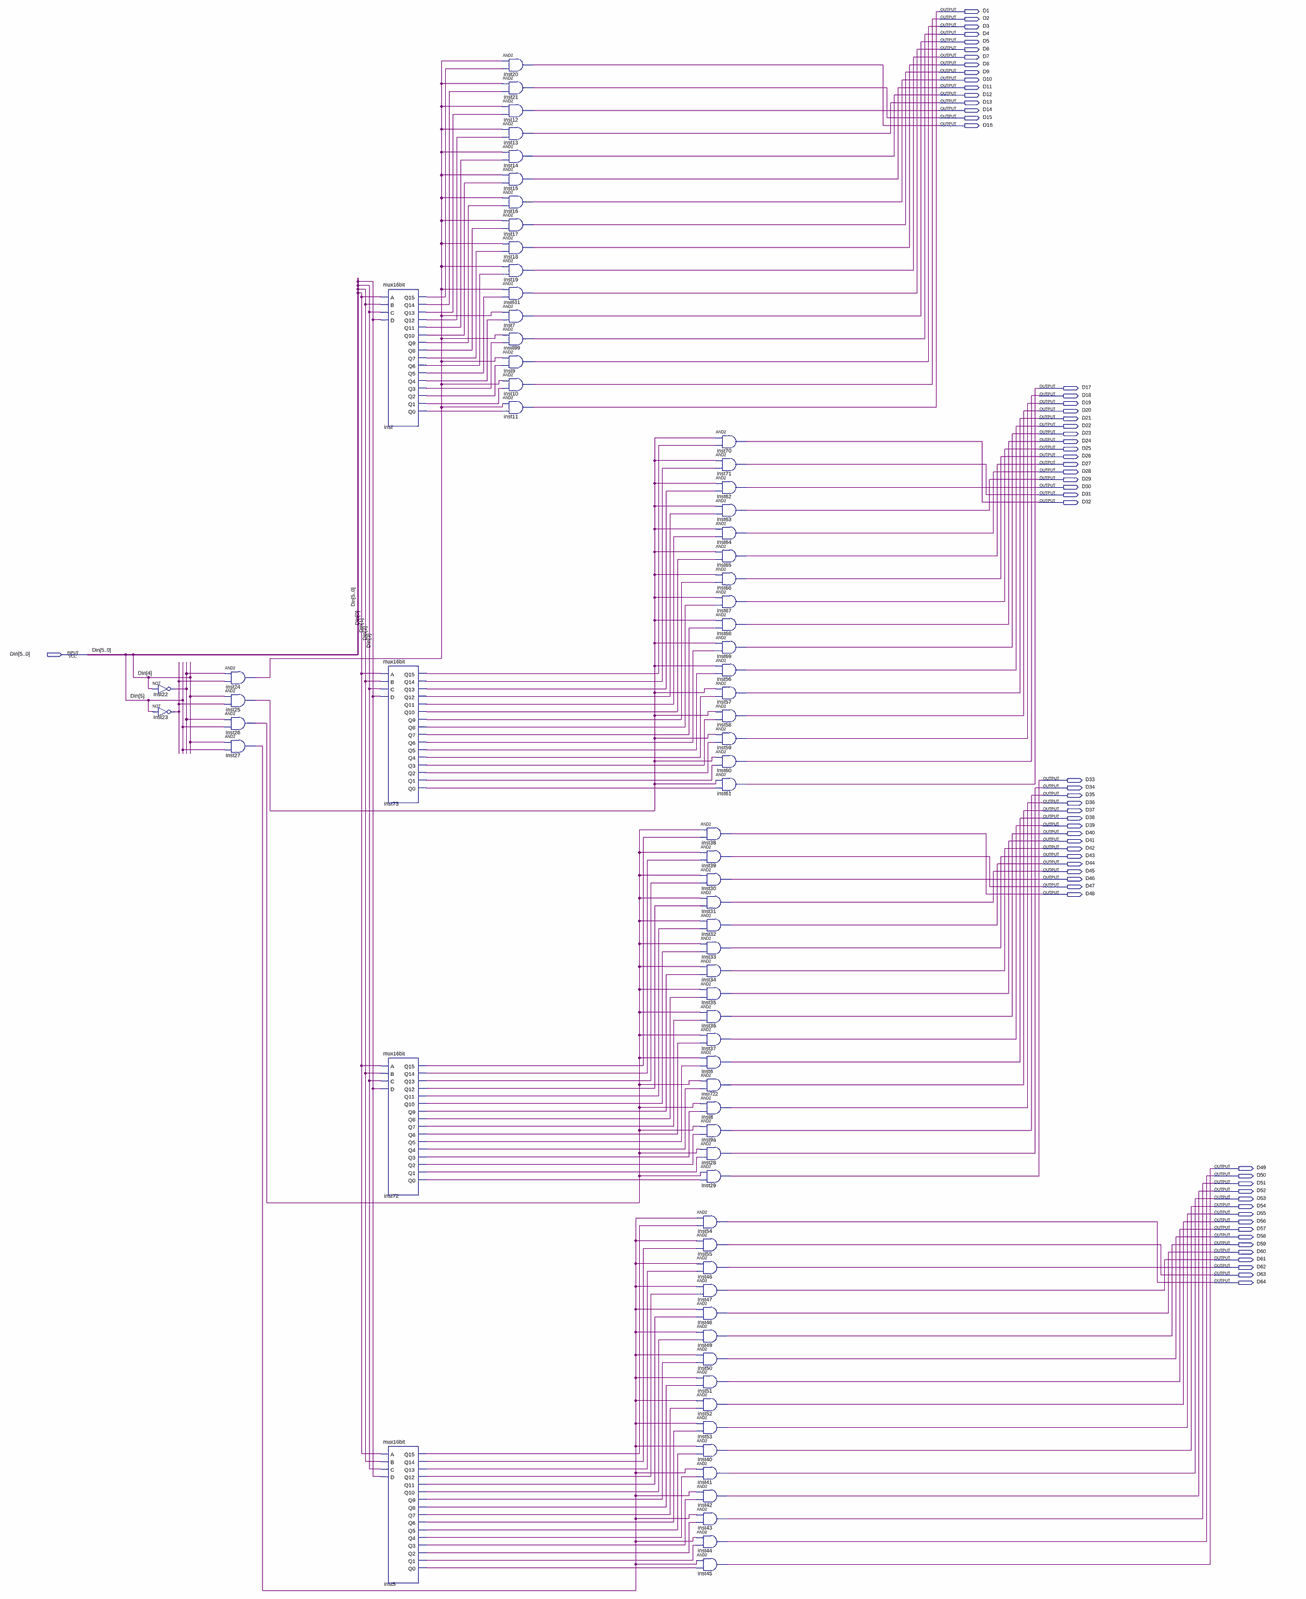
[diagram p0: schematic sheet, whole]
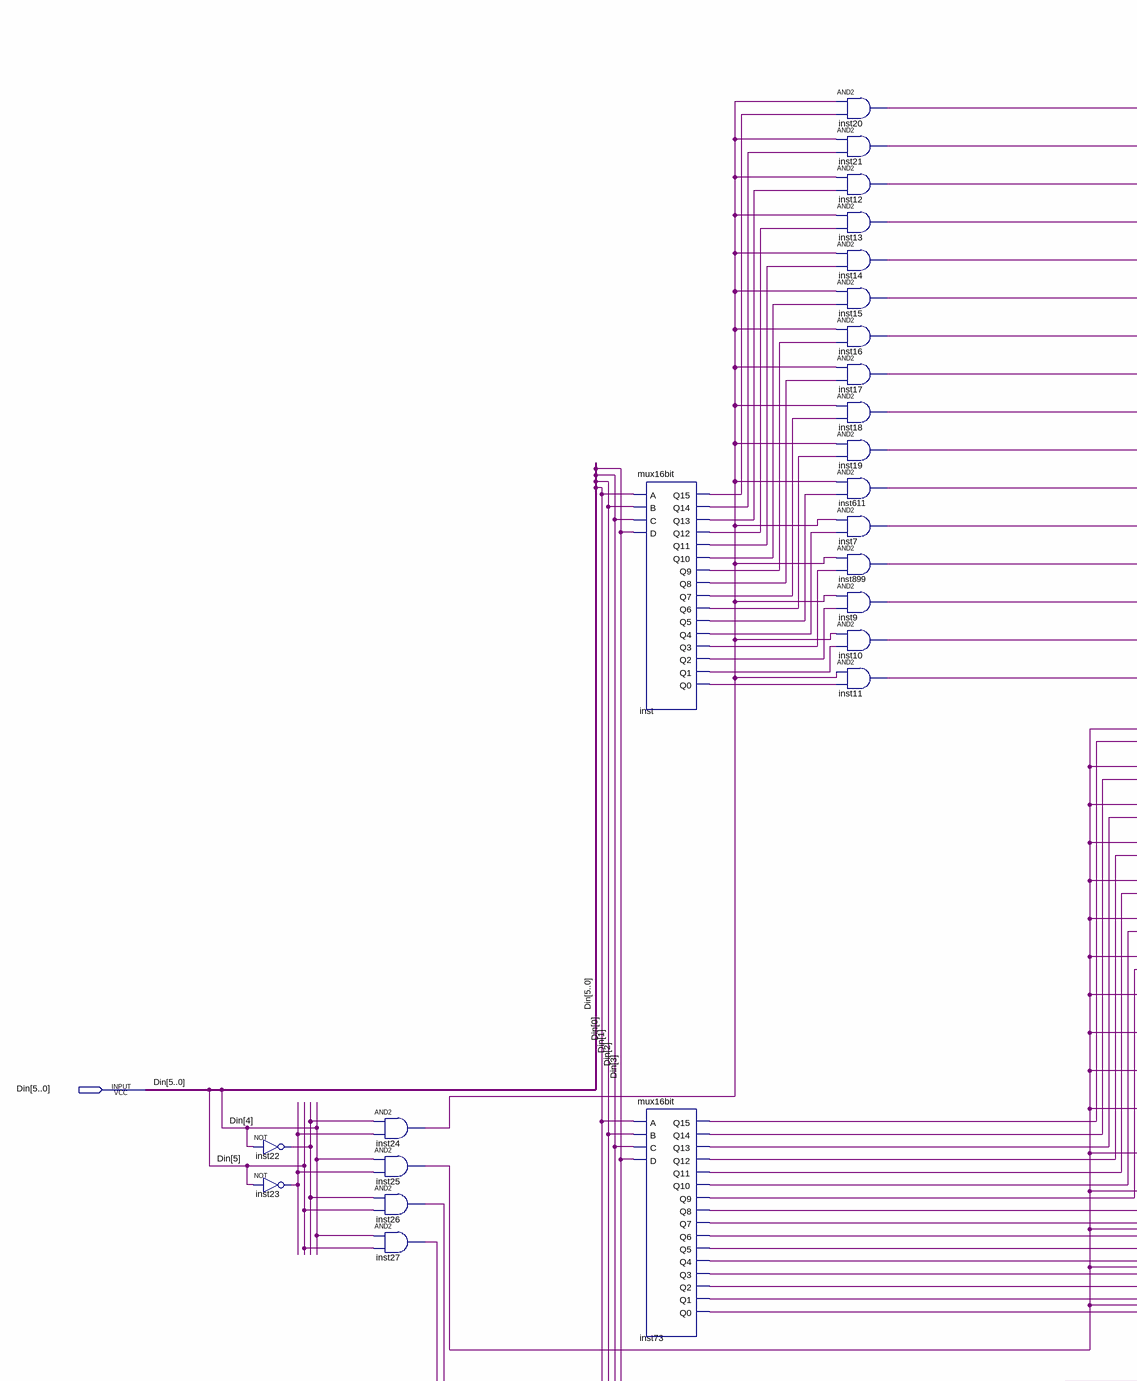
[diagram p1: schematic sheet, upper left part]
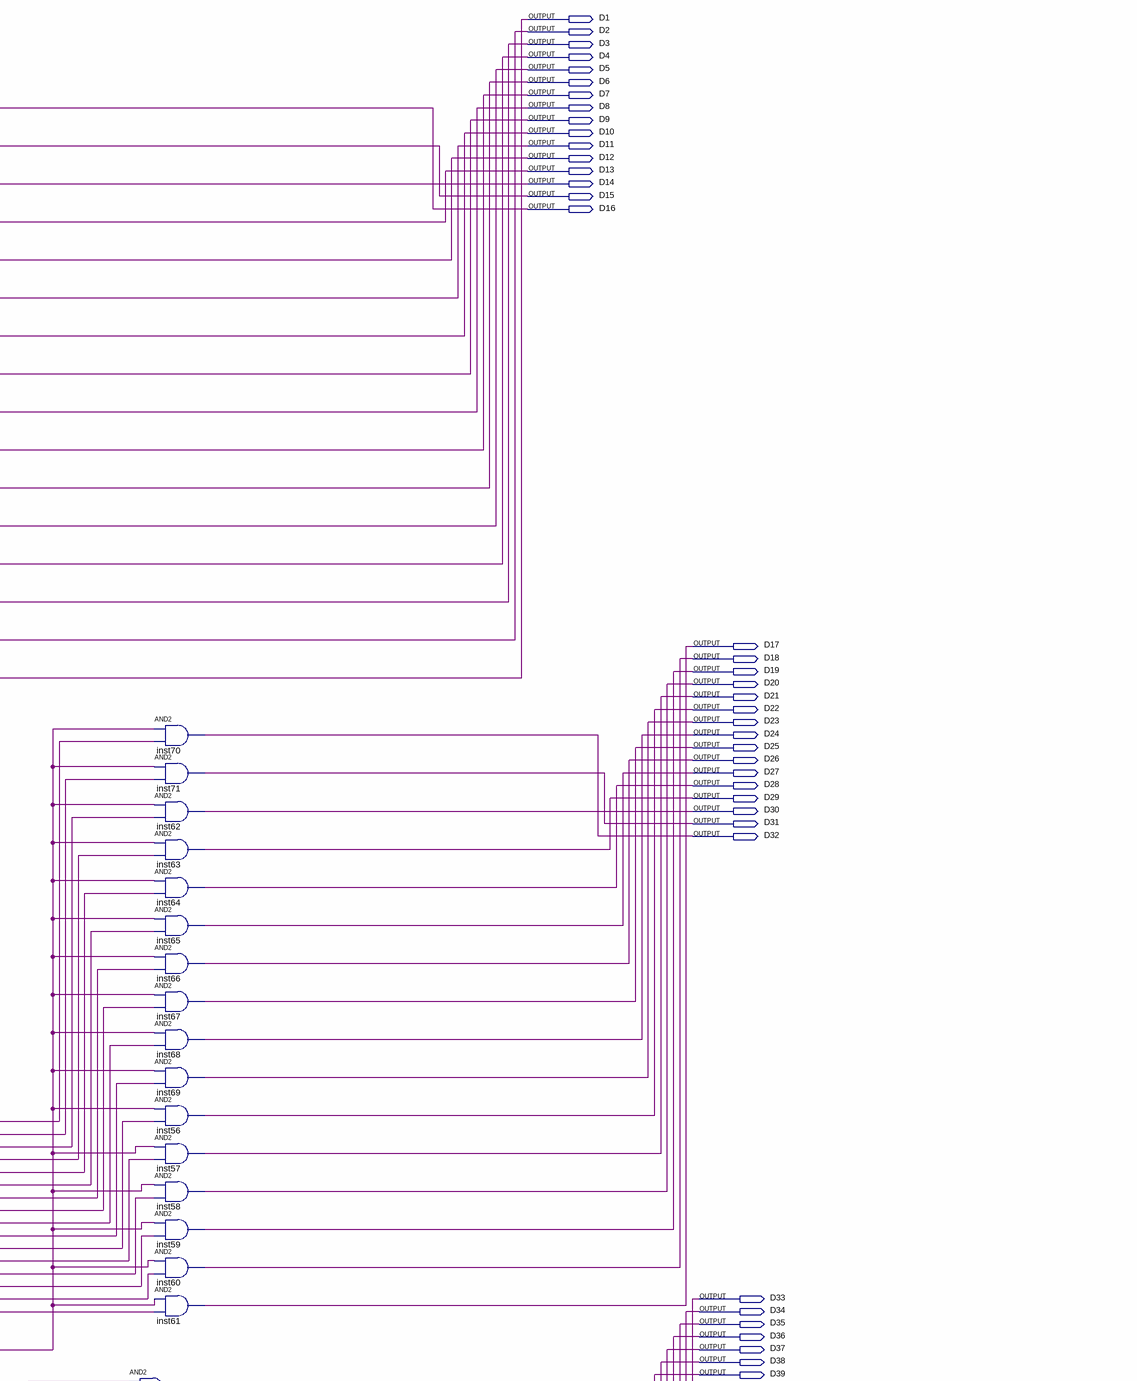
[diagram p2: schematic sheet, upper right part]
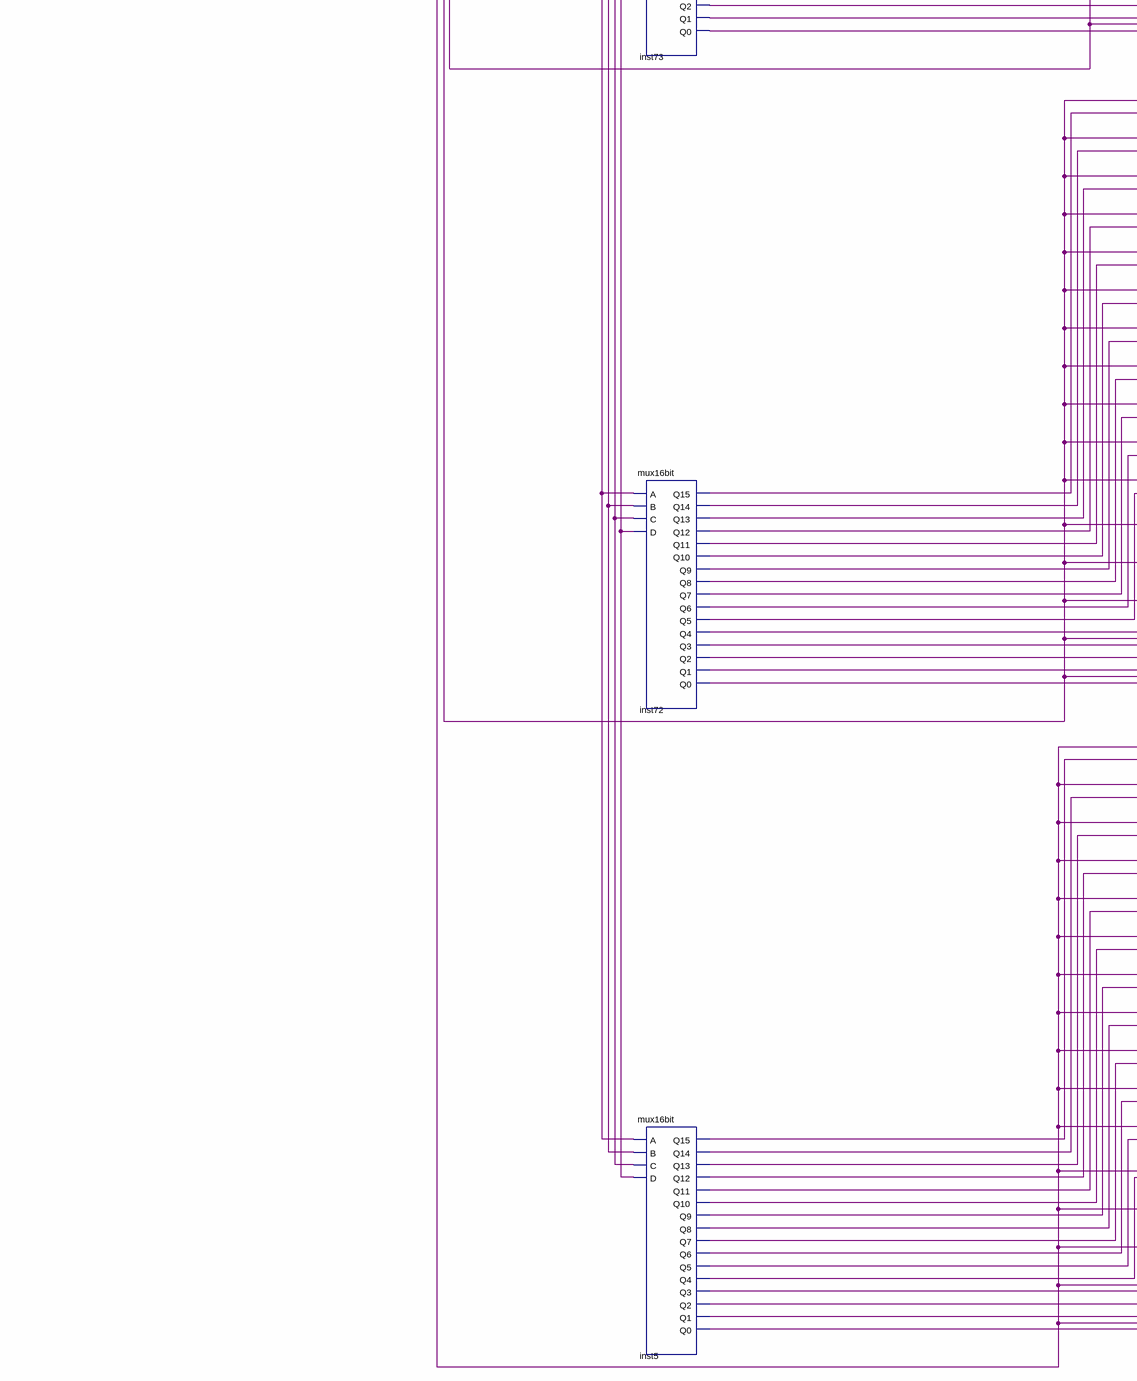
[diagram p3: schematic sheet, lower left part]
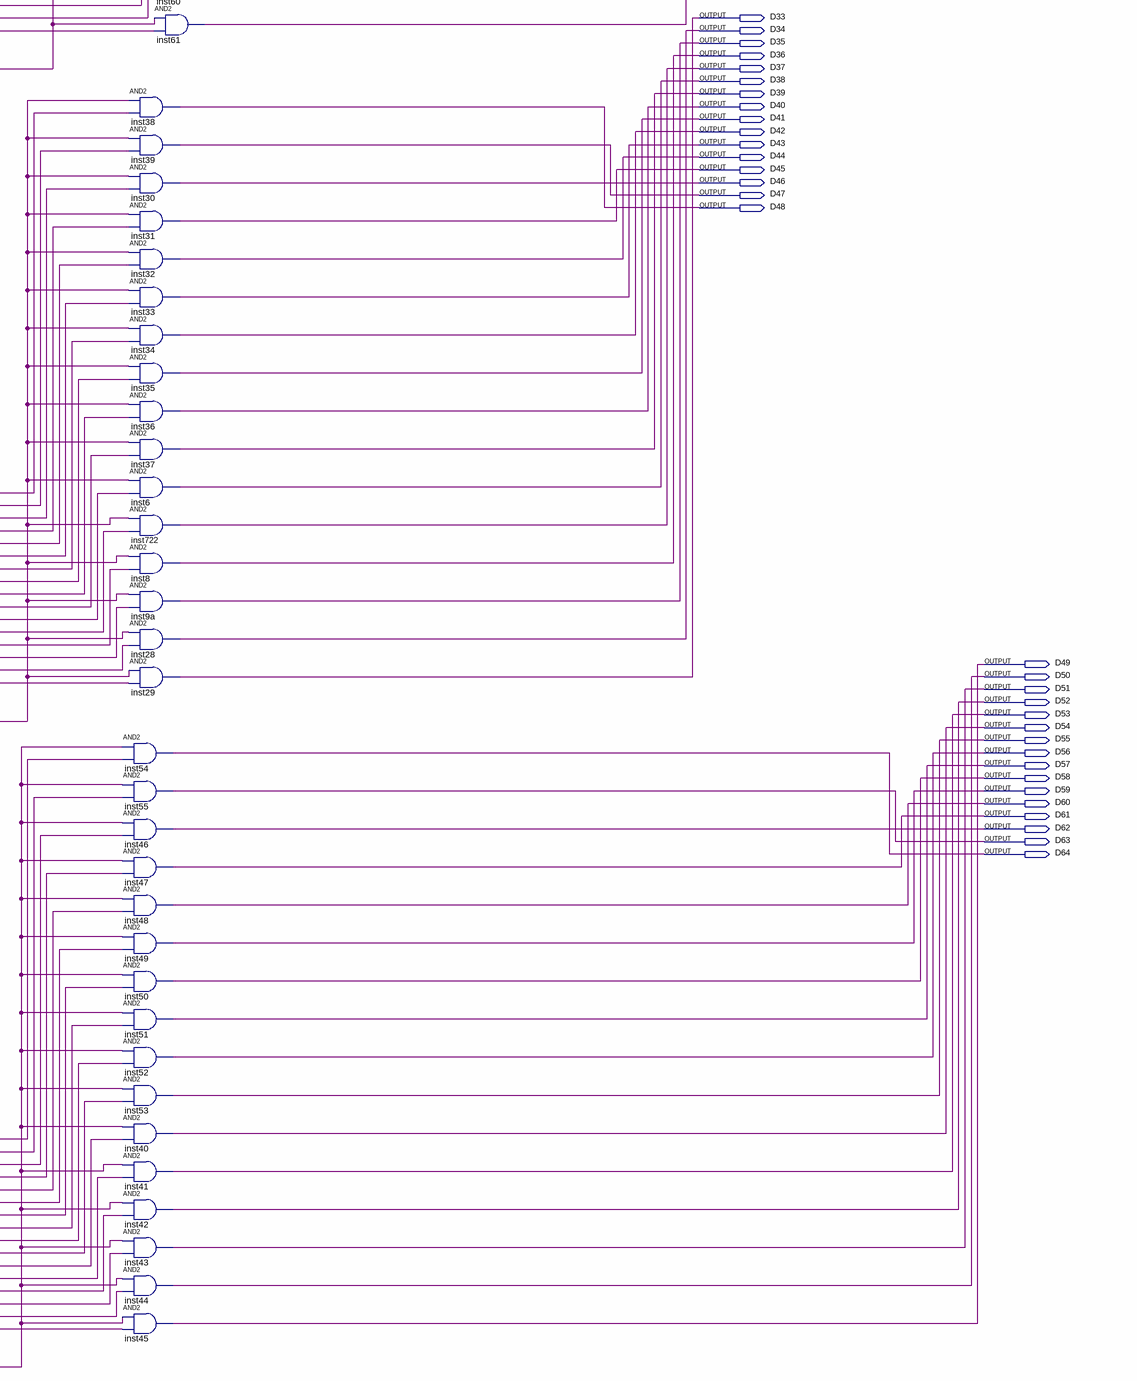
[diagram p4: schematic sheet, lower right part]
// Quartus schematic six_bit_decoder.bdf as structural Verilog: 74 symbols, 65 pins
module six_bit_decoder (
  input  [5:0] Din,
  output D1,
  output D2,
  output D3,
  output D4,
  output D5,
  output D6,
  output D7,
  output D8,
  output D9,
  output D10,
  output D11,
  output D12,
  output D13,
  output D14,
  output D15,
  output D16,
  output D17,
  output D18,
  output D19,
  output D20,
  output D21,
  output D22,
  output D23,
  output D24,
  output D25,
  output D26,
  output D27,
  output D28,
  output D29,
  output D30,
  output D31,
  output D32,
  output D33,
  output D34,
  output D35,
  output D36,
  output D37,
  output D38,
  output D39,
  output D40,
  output D41,
  output D42,
  output D43,
  output D44,
  output D45,
  output D46,
  output D47,
  output D48,
  output D49,
  output D50,
  output D51,
  output D52,
  output D53,
  output D54,
  output D55,
  output D56,
  output D57,
  output D58,
  output D59,
  output D60,
  output D61,
  output D62,
  output D63,
  output D64
);

  wire inst5_q0, inst5_q1, inst5_q2, inst5_q3, inst5_q4, inst5_q5, inst5_q6, inst5_q7, inst5_q8, inst5_q9,
       inst5_q10, inst5_q11, inst5_q12, inst5_q13, inst5_q14, inst5_q15, inst22_out, inst23_out, inst24_out,
       inst25_out, inst26_out, inst27_out, inst72_q0, inst72_q1, inst72_q2, inst72_q3, inst72_q4, inst72_q5,
       inst72_q6, inst72_q7, inst72_q8, inst72_q9, inst72_q10, inst72_q11, inst72_q12, inst72_q13,
       inst72_q14, inst72_q15, inst73_q0, inst73_q1, inst73_q2, inst73_q3, inst73_q4, inst73_q5, inst73_q6,
       inst73_q7, inst73_q8, inst73_q9, inst73_q10, inst73_q11, inst73_q12, inst73_q13, inst73_q14,
       inst73_q15, inst_q0, inst_q1, inst_q2, inst_q3, inst_q4, inst_q5, inst_q6, inst_q7, inst_q8, inst_q9,
       inst_q10, inst_q11, inst_q12, inst_q13, inst_q14, inst_q15;

  not inst22 (inst22_out, Din[4]);
  not inst23 (inst23_out, Din[5]);
  and inst24 (inst24_out, inst22_out, inst23_out);
  and inst25 (inst25_out, Din[4], inst23_out);
  and inst26 (inst26_out, inst22_out, Din[5]);
  and inst27 (inst27_out, Din[4], Din[5]);
  mux16bit inst (
    .A(Din[0]), .B(Din[1]), .C(Din[2]), .D(Din[3]), .Q15(inst_q15), .Q14(inst_q14), .Q13(inst_q13),
    .Q12(inst_q12), .Q11(inst_q11), .Q10(inst_q10), .Q9(inst_q9), .Q8(inst_q8), .Q7(inst_q7), .Q6(inst_q6),
    .Q5(inst_q5), .Q4(inst_q4), .Q3(inst_q3), .Q2(inst_q2), .Q1(inst_q1), .Q0(inst_q0));
  mux16bit inst73 (
    .A(Din[0]), .B(Din[1]), .C(Din[2]), .D(Din[3]), .Q15(inst73_q15), .Q14(inst73_q14), .Q13(inst73_q13),
    .Q12(inst73_q12), .Q11(inst73_q11), .Q10(inst73_q10), .Q9(inst73_q9), .Q8(inst73_q8), .Q7(inst73_q7),
    .Q6(inst73_q6), .Q5(inst73_q5), .Q4(inst73_q4), .Q3(inst73_q3), .Q2(inst73_q2), .Q1(inst73_q1),
    .Q0(inst73_q0));
  mux16bit inst72 (
    .A(Din[0]), .B(Din[1]), .C(Din[2]), .D(Din[3]), .Q15(inst72_q15), .Q14(inst72_q14), .Q13(inst72_q13),
    .Q12(inst72_q12), .Q11(inst72_q11), .Q10(inst72_q10), .Q9(inst72_q9), .Q8(inst72_q8), .Q7(inst72_q7),
    .Q6(inst72_q6), .Q5(inst72_q5), .Q4(inst72_q4), .Q3(inst72_q3), .Q2(inst72_q2), .Q1(inst72_q1),
    .Q0(inst72_q0));
  mux16bit inst5 (
    .A(Din[0]), .B(Din[1]), .C(Din[2]), .D(Din[3]), .Q15(inst5_q15), .Q14(inst5_q14), .Q13(inst5_q13),
    .Q12(inst5_q12), .Q11(inst5_q11), .Q10(inst5_q10), .Q9(inst5_q9), .Q8(inst5_q8), .Q7(inst5_q7),
    .Q6(inst5_q6), .Q5(inst5_q5), .Q4(inst5_q4), .Q3(inst5_q3), .Q2(inst5_q2), .Q1(inst5_q1), .Q0(inst5_q0));
  and inst20 (D16, inst24_out, inst_q15);
  and inst21 (D15, inst24_out, inst_q14);
  and inst12 (D14, inst24_out, inst_q13);
  and inst13 (D13, inst24_out, inst_q12);
  and inst14 (D12, inst24_out, inst_q11);
  and inst15 (D11, inst24_out, inst_q10);
  and inst16 (D10, inst24_out, inst_q9);
  and inst17 (D9, inst24_out, inst_q8);
  and inst18 (D8, inst24_out, inst_q7);
  and inst19 (D7, inst24_out, inst_q6);
  and inst611 (D6, inst24_out, inst_q5);
  and inst7 (D5, inst24_out, inst_q4);
  and inst899 (D4, inst24_out, inst_q3);
  and inst9 (D3, inst24_out, inst_q2);
  and inst10 (D2, inst24_out, inst_q1);
  and inst11 (D1, inst24_out, inst_q0);
  and inst38 (D48, inst26_out, inst72_q15);
  and inst39 (D47, inst26_out, inst72_q14);
  and inst30 (D46, inst26_out, inst72_q13);
  and inst31 (D45, inst26_out, inst72_q12);
  and inst32 (D44, inst26_out, inst72_q11);
  and inst33 (D43, inst26_out, inst72_q10);
  and inst34 (D42, inst26_out, inst72_q9);
  and inst35 (D41, inst26_out, inst72_q8);
  and inst36 (D40, inst26_out, inst72_q7);
  and inst37 (D39, inst26_out, inst72_q6);
  and inst6 (D38, inst26_out, inst72_q5);
  and inst722 (D37, inst26_out, inst72_q4);
  and inst8 (D36, inst26_out, inst72_q3);
  and inst9a (D35, inst26_out, inst72_q2);
  and inst28 (D34, inst26_out, inst72_q1);
  and inst29 (D33, inst26_out, inst72_q0);
  and inst54 (D64, inst27_out, inst5_q15);
  and inst55 (D63, inst27_out, inst5_q14);
  and inst46 (D62, inst27_out, inst5_q13);
  and inst47 (D61, inst27_out, inst5_q12);
  and inst48 (D60, inst27_out, inst5_q11);
  and inst49 (D59, inst27_out, inst5_q10);
  and inst50 (D58, inst27_out, inst5_q9);
  and inst51 (D57, inst27_out, inst5_q8);
  and inst52 (D56, inst27_out, inst5_q7);
  and inst53 (D55, inst27_out, inst5_q6);
  and inst40 (D54, inst27_out, inst5_q5);
  and inst41 (D53, inst27_out, inst5_q4);
  and inst42 (D52, inst27_out, inst5_q3);
  and inst43 (D51, inst27_out, inst5_q2);
  and inst44 (D50, inst27_out, inst5_q1);
  and inst45 (D49, inst27_out, inst5_q0);
  and inst70 (D32, inst25_out, inst73_q15);
  and inst71 (D31, inst25_out, inst73_q14);
  and inst62 (D30, inst25_out, inst73_q13);
  and inst63 (D29, inst25_out, inst73_q12);
  and inst64 (D28, inst25_out, inst73_q11);
  and inst65 (D27, inst25_out, inst73_q10);
  and inst66 (D26, inst25_out, inst73_q9);
  and inst67 (D25, inst25_out, inst73_q8);
  and inst68 (D24, inst25_out, inst73_q7);
  and inst69 (D23, inst25_out, inst73_q6);
  and inst56 (D22, inst25_out, inst73_q5);
  and inst57 (D21, inst25_out, inst73_q4);
  and inst58 (D20, inst25_out, inst73_q3);
  and inst59 (D19, inst25_out, inst73_q2);
  and inst60 (D18, inst25_out, inst73_q1);
  and inst61 (D17, inst25_out, inst73_q0);
endmodule
